# Altium schematic sheet Linear Actuator V3.1_SchDoc.SchDoc
size A; SheetNumber: 1; SheetTotal: 3
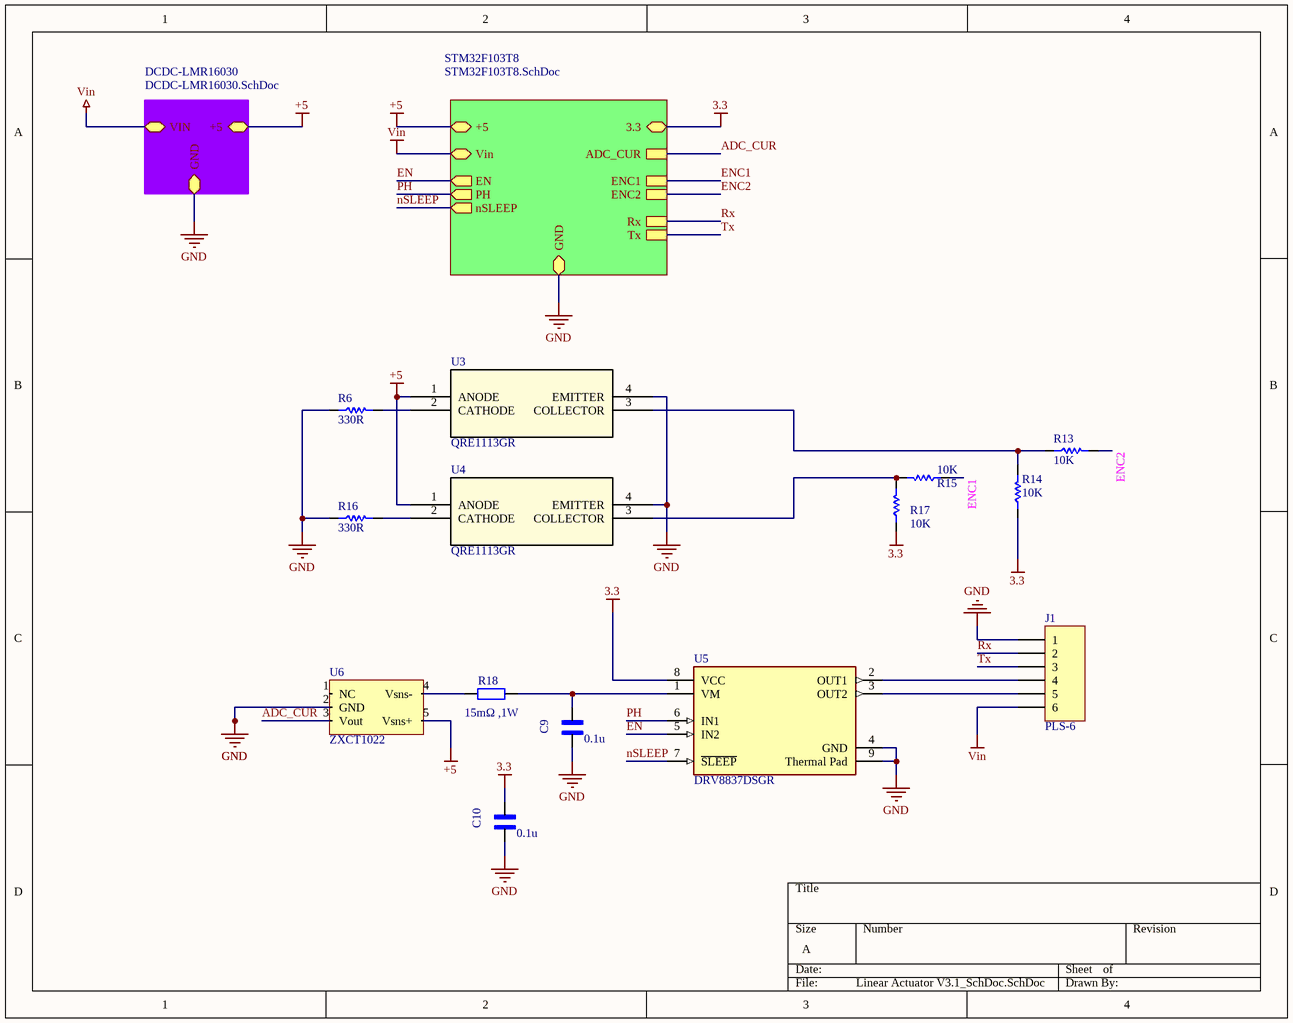
[diagram p0: Linear Actuator V3.1_SchDoc.SchDoc]

## Parts
C9  value 0.1u  [*CAPC1608X90]  (hidden comment: GX035C104MAT2-500)
C10  value 0.1u  [*CAPC1608X90]  (hidden comment: GX035C104MAT2-500)
J1  PLS-6  [HDR Side 6 pin]
R6  330R  [RES 0603 (1608X06L)]
R13  10K  [RES 0603 (1608X06L)]
R14  10K  [RES 0603 (1608X06L)]
R15  10K  [RES 0603 (1608X06L)]
R16  330R  [RES 0603 (1608X06L)]
R17  10K  [RES 0603 (1608X06L)]
R18  value 15mΩ ,1W  [RES2512]  (hidden comment: resistor)
U3  QRE1113GR  [SMD4_2P90X3P60_ONS]
U4  QRE1113GR  [SMD4_2P90X3P60_ONS]
U5  DRV8837DSGR  [FP-DSG0008A-MFG]
U6  ZXCT1022  [SOT23-5]

## Sub-sheets
DCDC-LMR16030 = DCDC-LMR16030.SchDoc: GND (bidir), VIN (bidir), +5 (bidir)
STM32F103T8 = STM32F103T8.SchDoc: GND (bidir), +5 (bidir), 3.3 (bidir), Vin (bidir), ADC_CUR, ENC1, ENC2, EN (out), PH (out), nSLEEP (out), Rx, Tx

## Nets
3.3: C10.1 R14.1 R17.1 U5.8(VCC) ; sheet STM32F103T8/3.3
+5: U3.1(ANODE) U4.1(ANODE) U6.5(Vsns+) ; sheet DCDC-LMR16030/+5, sheet STM32F103T8/+5
GND: C9.2 C10.2 J1.1 R6.1 R16.1 U3.4(EMITTER) U4.4(EMITTER) U5.4(GND) U5.9(Thermal_Pad) U6.2(GND) ; sheet DCDC-LMR16030/GND, sheet STM32F103T8/GND
Vin: J1.6 ; sheet DCDC-LMR16030/VIN, sheet STM32F103T8/Vin
ADC_CUR: U6.3(Vout) ; sheet STM32F103T8/ADC_CUR
EN: U5.5(IN2) ; sheet STM32F103T8/EN
ENC1: R15.1 ; sheet STM32F103T8/ENC1
ENC2: R13.2 ; sheet STM32F103T8/ENC2
nSLEEP: U5.7(~{SLEEP}) ; sheet STM32F103T8/nSLEEP
PH: U5.6(IN1) ; sheet STM32F103T8/PH
Rx: J1.2 ; sheet STM32F103T8/Rx
Tx: J1.3 ; sheet STM32F103T8/Tx
NetC9_1: C9.1 R18.2 U5.1(VM)
NetJ1_4: J1.4 U5.2(OUT1)
NetJ1_5: J1.5 U5.3(OUT2)
NetR6_2: R6.2 U3.2(CATHODE)
NetR13_1: R13.1 R14.2 U3.3(COLLECTOR)
NetR15_2: R15.2 R17.2 U4.3(COLLECTOR)
NetR16_2: R16.2 U4.2(CATHODE)
NetR18_1: R18.1 U6.4(Vsns-)

Not connected (* = marked no-connect by the designer): U6 1(NC)

## Library data of the parts
C9 C10 = GX035C104MAT2-500: Cap Thin Film 0.1uf 50v 0603; MF: AVX; MP: GX035C104MAT2-500 or CL10B104JB8NNNC; Pacage Metric: 1608; Type: SMD; Package: 0603 AVX; SnapEDA_Link: https://www.snapeda.com/parts/GX035C104MAT2-500/AVX/view-part/?ref=snap
J1 = PLS-6: PLS-6 (DS1021-1x6), Вилка штыревая 2.54мм 1x6 прямая тип1; Instructions: DNP; ChipDip_Link: https://www.chipdip.ru/product/pls-6; MP: PLS-6; Type: SMD
R6 R13-R17 = Resistor: Tolerance: 5%; Power: 1/8 W
  R6 R16: Value: 330R
  R13-R15 R17: Value: 10K
U3 U4 = QRE1113GR: No Description Available; Vendor: ON Semiconductor; Built_By: Ehsan Shaghaei; SourceLibrary: ON_Semiconductor_2019-12-30; Manufacturer_Part_Number: QRE1113GR; Copyright: Copyright (C) 2018 Accelerated Designs. All rights reserved; RefDes: RefDes; Type: DEV; ComponentLink1Description: New link; ComponentLink1URL: *; ChipDip_Link: https://www.chipdip.ru/product/qre1113gr-fairchild
U5 = CMP-04915-000004-1: IC MOTOR DRIVER PAR 8WSON; Manufacturer: Texas Instruments; Switching Frequency: 0-250kHz; Min Supply Voltage: 1.8V; Standoff Height: 0mm; Max Supply Voltage: 7V; Output Voltage: 0-11V; Motor Type: Brushed; Number Of Outputs: 2; Output Current: 1.8A; Max Junction Temp: +150°C; Nominal Supply Current: 300-700uA; Mouser Description: Motor / Motion / Ignition Controllers & Drivers 1.8A Low Vltg Brush DC Motor Driver; Device Class L2: Power Management ICs; Manufacturer Part Number: DRV8837DSGR; Temperature Range Low: -40°C; Lead Free: Yes; Height: 0.8mm; Device Class L3: Motor Drivers; Octopart: https://octopart.com/drv8837dsgr-texas+instruments-23786726; Package: DSG0008A; ComponentLink2URL: https://www.chipdip.ru/product0/8004320325; Temperature: -40°C to +85°C; Ambient Temperature Range Low: -40°C; ComponentLink2Description: ChipDip_Link; Ambient Temperature Range High: +85°C; Device Class L1: Integrated Circuits (ICs); Category: IC; Temperature Range High: +85°C; RoHS: TRUE; Automotive: No; Digikey Description: IC MOTOR DRIVER PAR 8WSON; ComponentLink3Description: HelpURL; ComponentLink3URL: http://www.ti.com/lit/ds/symlink/drv8837.pdf
R18 = resistor: Published: 8-Jun-2000; LatestRevisionDate: 17-Jul-2002; LatestRevisionNote: Re-released for DXP Platform.; PackageReference: AXIAL-0.4; Publisher: Altium Limited
U6 = ZXCT1022: HelpURL: https://static.chipdip.ru/lib/465/DOC012465896.pdf; Chipdip_Link: https://www.chipdip.ru/product/zxct1022e5ta-current-sense-monitor-2.5